# EAGLE design Accelerometer breakout (EAGLE 9.6.2)
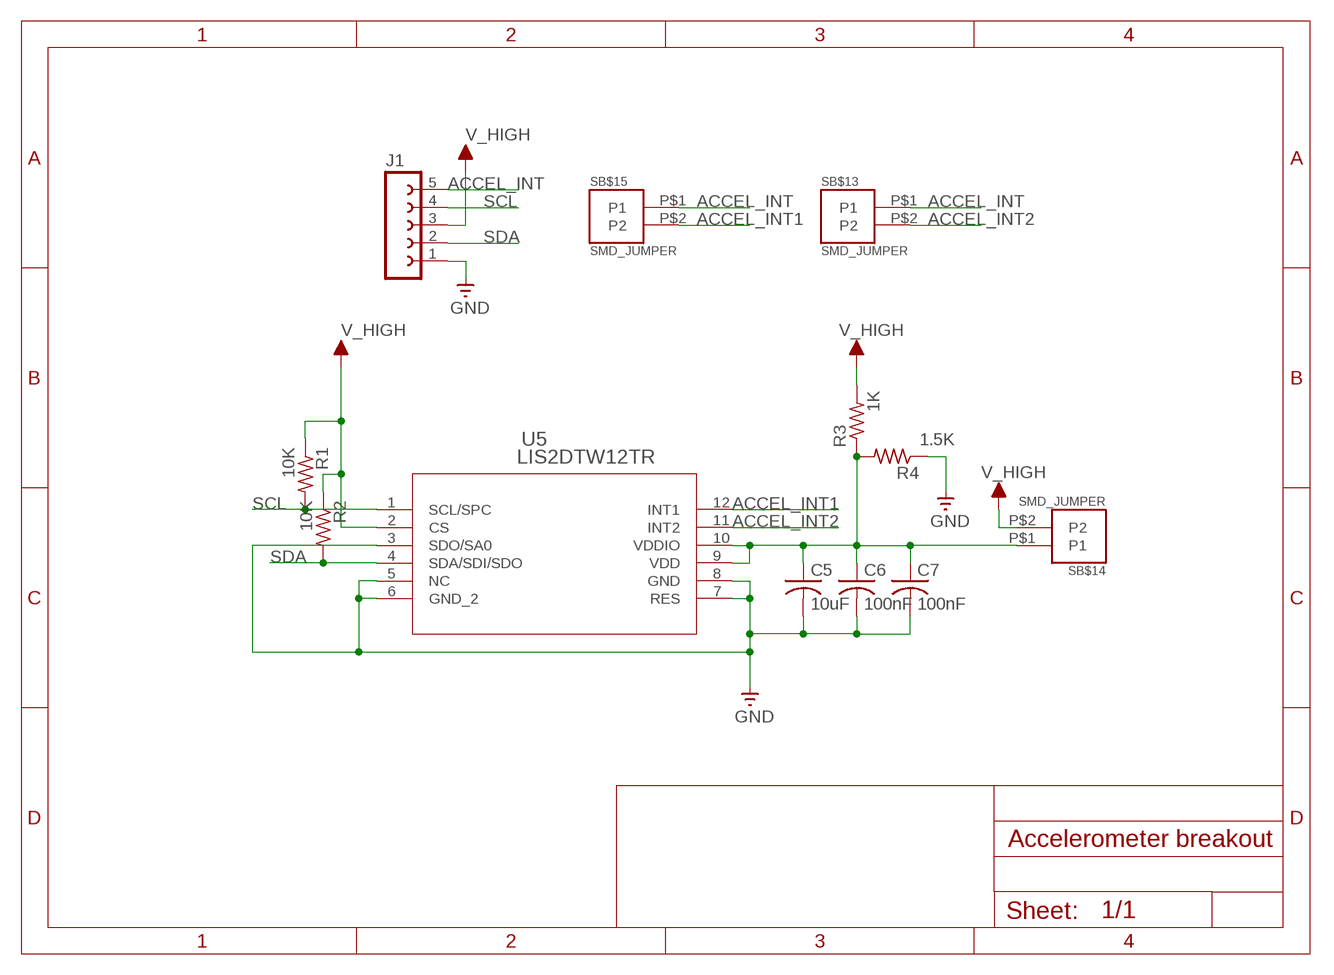
[diagram p0: schematic, sheet 1]

## Parts
C5  10uF  C-USC0603  [C0603]
C6  100nF  C-USC0603  [C0603]
C7  100nF  C-USC0603  [C0603]
J1  FE05-1  [FE05-1]
R1  10K  R-US_R0603  [R0603]
R2  10K  R-US_R0603  [R0603]
R3  1K  R-US_R0603  [R0603]
R4  1.5K  R-US_R0603  [R0603]
SB$13  SMD_JUMPER  [SMD_JUMPER]
SB$14  SMD_JUMPER  [SMD_JUMPER]
SB$15  SMD_JUMPER  [SMD_JUMPER]
U5  LIS2DTW12TR  [LGA_DTW12_STM]

## Nets
ACCEL_INT: J1.5 SB$13.P$1(P1) SB$15.P$1(P1)
ACCEL_INT1: SB$15.P$2(P2) U5.12(INT1)
ACCEL_INT2: SB$13.P$2(P2) U5.11(INT2)
GND: C5.2 C6.2 C7.2 J1.1 R4.1 U5.3(SDO/SA0) U5.5(NC) U5.6(GND_2) U5.7(RES) U5.8(GND)
N$17: C5.1 C6.1 C7.1 R3.1 R4.2 SB$14.P$1(P1) U5.9(VDD) U5.10(VDDIO)
SCL: J1.4 R1.2 U5.1(SCL/SPC)
SDA: J1.2 R2.2 U5.4(SDA/SDI/SDO)
V_HIGH: J1.3 R1.1 R2.1 R3.2 SB$14.P$2(P2) U5.2(CS)

## Library data of the parts
C5-C7 = rcl:C-US: CAPACITOR, American symbol; SPICEPREFIX: C
J1 = con-lsta:FE05-1: FEMALE HEADER; OC_FARNELL: unknown; OC_NEWARK: unknown
R1-R4 = rcl:R-US_: RESISTOR, American symbol; SPICEPREFIX: R
SB$13-SB$15 = Solder_Jumpers:SMD_JUMPER
U5 = Accelerometers:LIS2DTW12TR; COPYRIGHT: Copyright (C) 2021 Ultra Librarian. All rights reserved.; DIGI-KEY_PART_NUMBER_1: 497-19047-2-ND; DIGI-KEY_PART_NUMBER_2: 497-19047-1-ND; DIGI-KEY_PART_NUMBER_3: 497-19047-6-ND; MANUFACTURER_PART_NUMBER: LIS2DTW12TR; MFR_NAME: STMicroelectronics

## Board
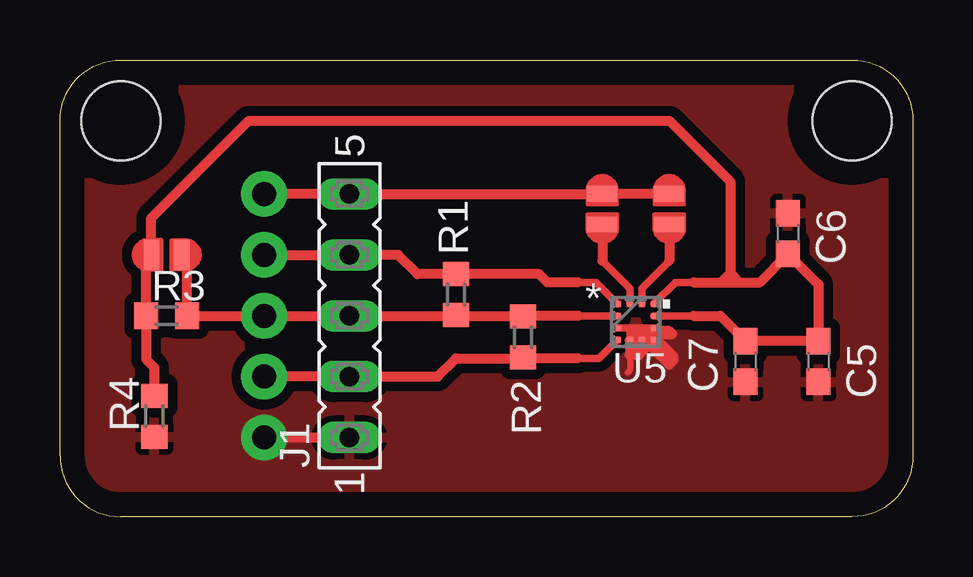
[diagram p1: board, top side]
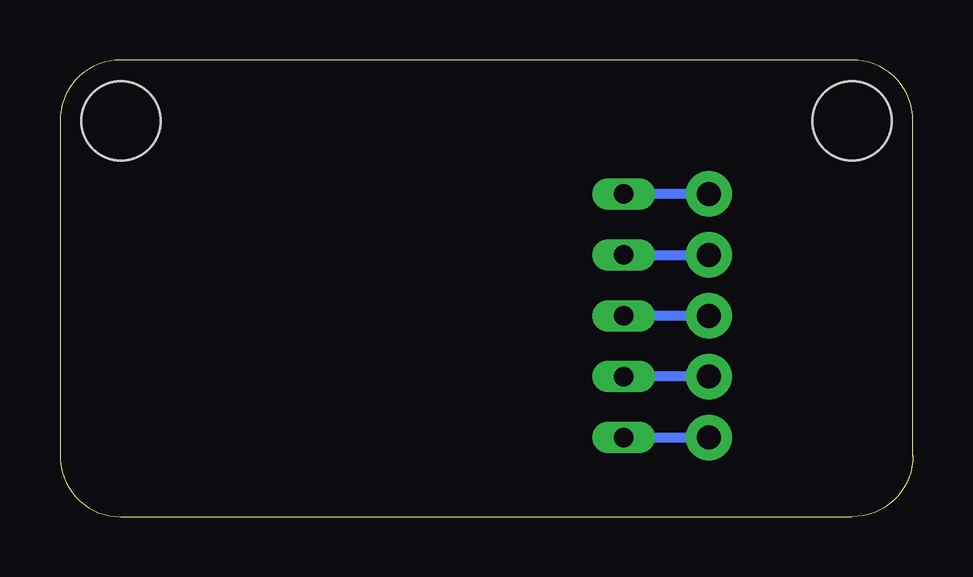
[diagram p2: board, bottom side, seen from below]

Size 35.56 x 19.05 mm. Coordinates in mm from the lower left corner, seen from the top.
Outline: 0,2.54 0,16.51 arc-90 2.54,19.05 33.02,19.05 arc-90 35.56,16.51 35.56,2.54 arc-90 33.02,0 2.54,0 arc-90 0,2.54
Copper layers (1*16): Top 0.035mm / dielectric 1.5mm / Bottom 0.035mm
Design rules "default": minimum track width 6mil, minimum drill 0.35mm, track to track 6mil, track to pad 6mil, pad to pad 6mil, via to via 6mil, smd to smd 6mil, copper to edge 40mil, drill to drill 6mil, minimum pad ring 10mil, minimum via ring 8mil, stop-mask expansion 4mil, vias tented up to drill 0mil, thermal gap 10mil
Holes 3.3 mm at 2.54,16.51 33.02,16.51

### Footprints (pad centres in the part's own frame; a part is rotated, then mirrored left to right if it is on the bottom)
C0603 = smd 1.1 x 1: 1 -0.85,0; 2 0.85,0
FE05-1 = drill 0.813 long: 1 -5.08,0; 2 -2.54,0; 3 0,0; 4 2.54,0; 5 5.08,0
R0603 = smd 1 x 1.1: 1 -0.85,0; 2 0.85,0
SMD_JUMPER = smd 1.27 x 0.635: P$1 0,0.635; P$2 0,-0.635
LGA_DTW12_STM = smd 0.279 x 0.254: 1 -0.762,0.75; 2 -0.762,0.25; 3 -0.762,-0.25; 4 -0.762,-0.75; 7 0.762,-0.75; 8 0.762,-0.25; 9 0.762,0.25; 10 0.762,0.75 | smd 0.254 x 0.279: 5 -0.25,-0.762; 6 0.25,-0.762; 11 0.25,0.762; 12 -0.25,0.762

### Placement (x,y rotation side)
C5  31.62,6.48 270 top
C6  30.35,11.81 90 top
C7  28.57,6.48 270 top
J1  12.06,8.38 90 top
R1  16.51,9.27 90 top
R2  19.3,7.49 270 top
R3  4.45,8.38 0 top
R4  3.94,4.19 90 top
SB$13  25.4,12.83 0 top
SB$14  4.45,10.92 90 top
SB$15  22.61,12.83 0 top
U5  24,8.13 0 top

### Tracks (layer width: path | path; a pad name or v marks a point on that pad's centre or on a via)
ACCEL_INT  (via drill 1 pad 1.91)
  Top 0.406: SB$13.P$1 SB$15.P$1 J1.5 v8.51,13.46
  Bottom 0.406: v8.51,13.46 J1.5
ACCEL_INT1
  Top 0.305: U5.12 23.75,9.52 22.61,10.67
  Top 0.406: SB$15.P$2 22.61,10.67
ACCEL_INT2
  Top 0.305: U5.11 24.25,9.52 25.4,10.67
  Top 0.406: SB$13.P$2 25.4,10.67
GND  (via drill 1 pad 1.91)
  Top 0.254: U5.5 23.75,6.1 23.67,6.02
  Top 0.305: 24.77,7.75 U5.8 | U5.6 23.88,7.37 U5.5 23.75,7.87 | U5.3 23.75,7.88 23.75,7.87 | U5.6 24,7.62 | 24,7.62 23.75,7.87 | U5.8 U5.6 | U5.8 24.75,7.87 23.75,7.87 | U5.8 24.5,7.62 24,7.62
  Top 0.406: v8.51,3.3 J1.1 | U5.7 24.75,7.37 24.38,7.37 | 24.38,7.37 U5.6 | 24.77,7.75 25.4,7.75 25.53,7.62 25.01,7.62 24.82,7.44 25.59,6.67 25.59,6.54 25.4,6.35 24.77,6.99 U5.7 | U5.7 24.13,6.74 24.13,6.73 | U5.7 24.65,7.38 24.38,7.11 | 24.38,7.11 24,6.73 | U5.7 24.4,7.38 24.38,7.37 | U5.7 23.89,7.38 23.88,7.37 | U5.7 23.77,7.38 U5.5 23.75,6.74 24.38,7.37 | 24.38,7.37 24.38,7.11
  Bottom 0.406: J1.1 v8.51,3.3
  pour Top (isolate 0.406): 0,19.05 35.56,19.05 35.56,0 0,0
N$17
  Top 0.305: U5.9 25.52,8.38 26.41,8.38 | U5.10 25.65,9.78 26.42,9.78
  Top 0.406: 26.41,8.38 27.52,8.38 C7.1 C5.1 31.62,9.69 C6.1 29.17,9.78 28.32,9.78 | 26.42,9.78 27.56,9.78 | 27.56,9.78 27.94,9.78 | 27.94,9.78 28.32,9.78 | R4.2 3.94,6.22 3.6,6.57 R3.1 3.6,10.71 SB$14.P$1 3.81,12.45 7.87,16.51 25.4,16.51 27.94,13.97 27.94,10.16 | 27.94,10.16 27.94,9.78 | 27.94,10.16 27.56,9.78 | 27.94,10.16 28.32,9.78
SCL  (via drill 1 pad 1.91)
  Top 0.305: U5.1 22.34,9.78 21.59,9.78
  Top 0.406: 21.59,9.78 20.32,9.78 19.98,10.12 R1.2 14.9,10.12 14.1,10.92 J1.4 v8.51,10.92
  Bottom 0.406: J1.4 v8.51,10.92
SDA  (via drill 1 pad 1.91)
  Top 0.305: U5.4 22.47,6.6 21.59,6.6
  Top 0.406: 19.34,6.6 R2.2 | 21.59,6.6 19.34,6.6 | 19.34,6.6 16.51,6.6 15.75,5.84 J1.2 v8.51,5.84
  Bottom 0.406: v8.51,5.84 J1.2
V_HIGH  (via drill 0.35, 1 pad 1.91)
  Top 0.305: U5.2 21.59,8.38
  Top 0.406: 21.59,8.38 19.34,8.38 R2.1 16.59,8.34 16.55,8.38 | 16.55,8.38 R1.1 | 16.55,8.38 12.7,8.38 J1.3 v8.51,8.38 R3.2 5.29,10.71 SB$14.P$2
  Bottom 0.406: v8.51,8.38 J1.3